# Altium project Carrier-Board-DAC.PrjPcb
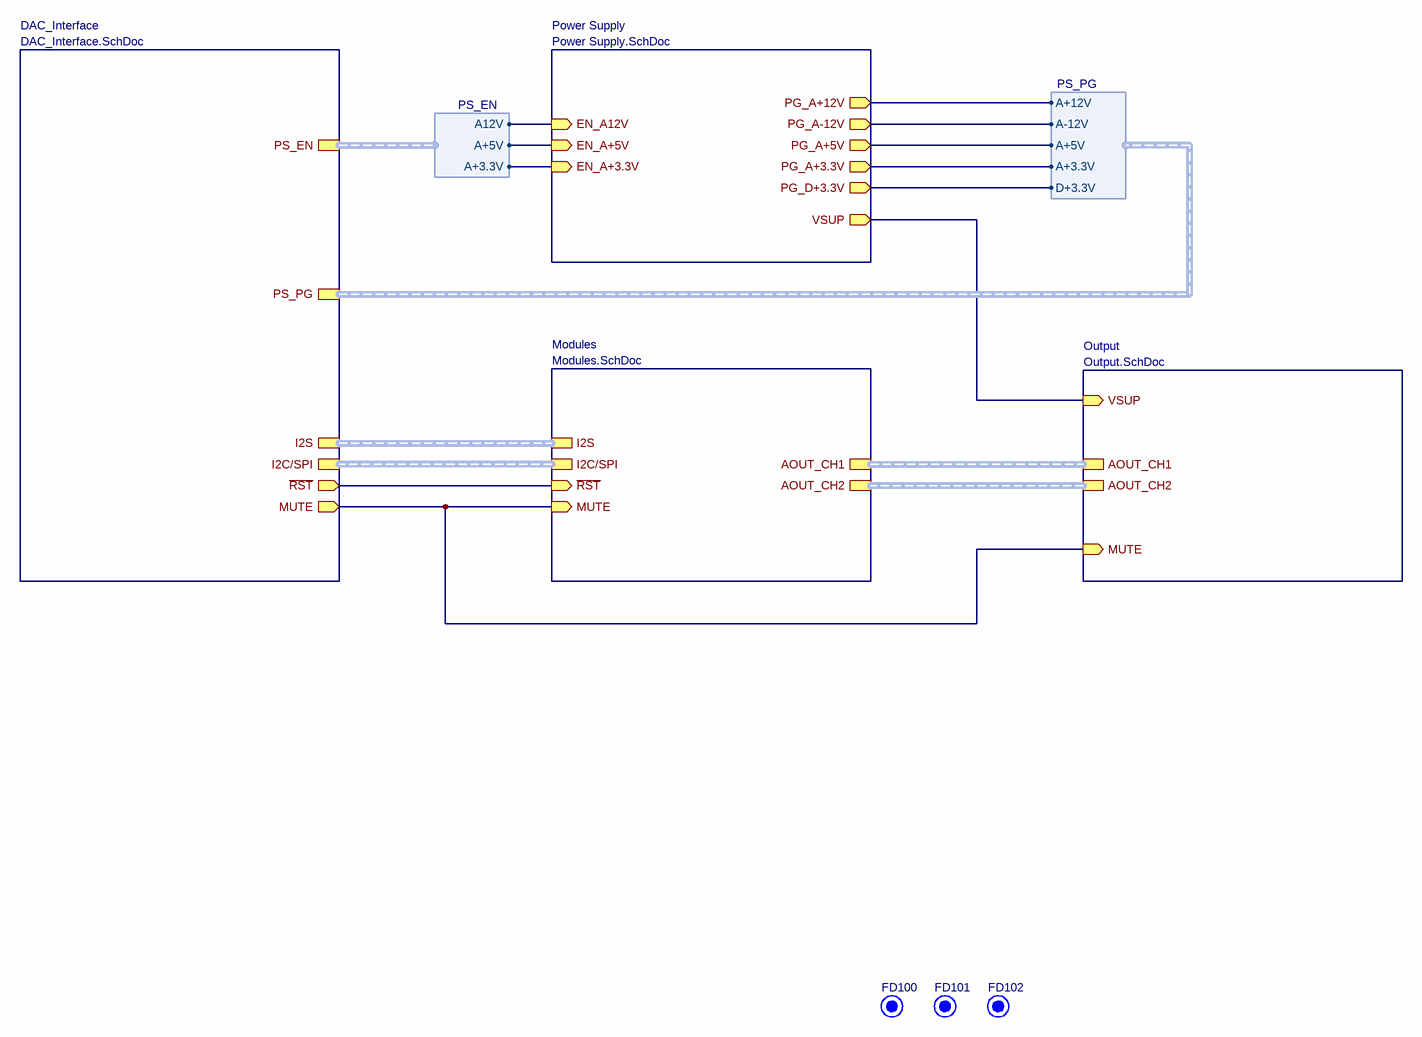
[diagram p0: Hardware Achitecture.SchDoc]
ProjectAuthors: Klossner, Lüthi; ProjectName: Carrier-Board-DAC; Revision: 1.1
5 sheets, 158 parts. Net scope: hierarchical (ports join the sheet entries above them; power ports are global).
Board file: Carrier-Board-DAC.PcbDoc
Sheets:
  Hardware Achitecture.SchDoc
    Power Supply = Power Supply.SchDoc
    DAC_Interface = DAC_Interface.SchDoc
    Modules = Modules.SchDoc
    Output = Output.SchDoc

## Sheet Hardware Achitecture.SchDoc
size A3; Date: 27.05.2014; DrawnBy: luths8; Organization: BFH; Address1: Bern University of Applied Sciences; Address2: Engineering and Information Technology; Address3: Jlcoweg 1; Address4: CH-3400 Burgdorf; DocumentNumber: 1; Revision: 1.1; SheetNumber: 1; SheetTotal: 5; CurrentDate: 27.05.2014

### Parts
FD100  Fiducial  [FIDUCIAL]  (value not drawn)  (no BOM)
FD101  Fiducial  [FIDUCIAL]  (value not drawn)  (no BOM)
FD102  Fiducial  [FIDUCIAL]  (value not drawn)  (no BOM)

### Sub-sheets
DAC_Interface = DAC_Interface.SchDoc: I2C/SPI (harness I2C/SPI), ~{RST} (out), I2S (harness I2S), MUTE (out), PS_PG (harness PS_PG), PS_EN (harness PS_EN)
Modules = Modules.SchDoc: I2C/SPI (harness I2C/SPI), ~{RST} (in), I2S (harness I2S), MUTE (in), AOUT_CH2 (harness AOUT), AOUT_CH1 (harness AOUT)
Output = Output.SchDoc: MUTE (in), VSUP (in), AOUT_CH2 (harness AOUT), AOUT_CH1 (harness AOUT)
Power Supply = Power Supply.SchDoc: PG_A-12V (out), EN_A12V (in), PG_A+3.3V (out), PG_D+3.3V (out), EN_A+3.3V (in), PG_A+12V (out), VSUP (out), EN_A+5V (in), PG_A+5V (out)

### Harnesses
PS_EN: A12V, A+3.3V, A+5V
PS_PG: A+12V, A-12V, A+3.3V, D+3.3V, A+5V

### Nets
~{DAC_RST}: sheet DAC_Interface/~{RST}, sheet Modules/~{RST}
DAC_MUTE: sheet DAC_Interface/MUTE, sheet Modules/MUTE, sheet Output/MUTE
PS_A12V_EN: sheet Power Supply/EN_A12V, sheet DAC_Interface/PS_EN.A12V
PS_A+3.3V_EN: sheet Power Supply/EN_A+3.3V, sheet DAC_Interface/PS_EN.A+3.3V
PS_A+3.3V_PG: sheet Power Supply/PG_A+3.3V, sheet DAC_Interface/PS_PG.A+3.3V
PS_A+5V_EN: sheet Power Supply/EN_A+5V, sheet DAC_Interface/PS_EN.A+5V
PS_A+5V_PG: sheet Power Supply/PG_A+5V, sheet DAC_Interface/PS_PG.A+5V
PS_A+12V_PG: sheet Power Supply/PG_A+12V, sheet DAC_Interface/PS_PG.A+12V
PS_A-12V_PG: sheet Power Supply/PG_A-12V, sheet DAC_Interface/PS_PG.A-12V
PS_D+3.3V_PG: sheet Power Supply/PG_D+3.3V, sheet DAC_Interface/PS_PG.D+3.3V
NetQ500_5: sheet Power Supply/VSUP, sheet Output/VSUP

### Buses and harness runs
harness sheet DAC_Interface/I2C/SPI = sheet Modules/I2C/SPI
harness sheet DAC_Interface/I2S = sheet Modules/I2S
harness sheet Modules/AOUT_CH1 = sheet Output/AOUT_CH1
harness sheet Modules/AOUT_CH2 = sheet Output/AOUT_CH2

### Notes on the sheet
- Project:
- Size:
- Sheet:
- Title:
- A3
- of
- Drawn by:
- Revision:
- Date:
- Variant:
- b
- File:

### Library data of the parts
FD100-FD102 = Fiducial: Fiducial Marker

## Sheet Power Supply.SchDoc
size A3; Date: 27.05.2014; DrawnBy: luths8; Organization: BFH; Address1: Bern University of Applied Sciences; Address2: Engineering and Information Technology; Address3: Jlcoweg 1; Address4: CH-3400 Burgdorf; DocumentNumber: 2; Revision: 1.1; SheetNumber: 2; SheetTotal: 5; CurrentDate: 27.05.2014
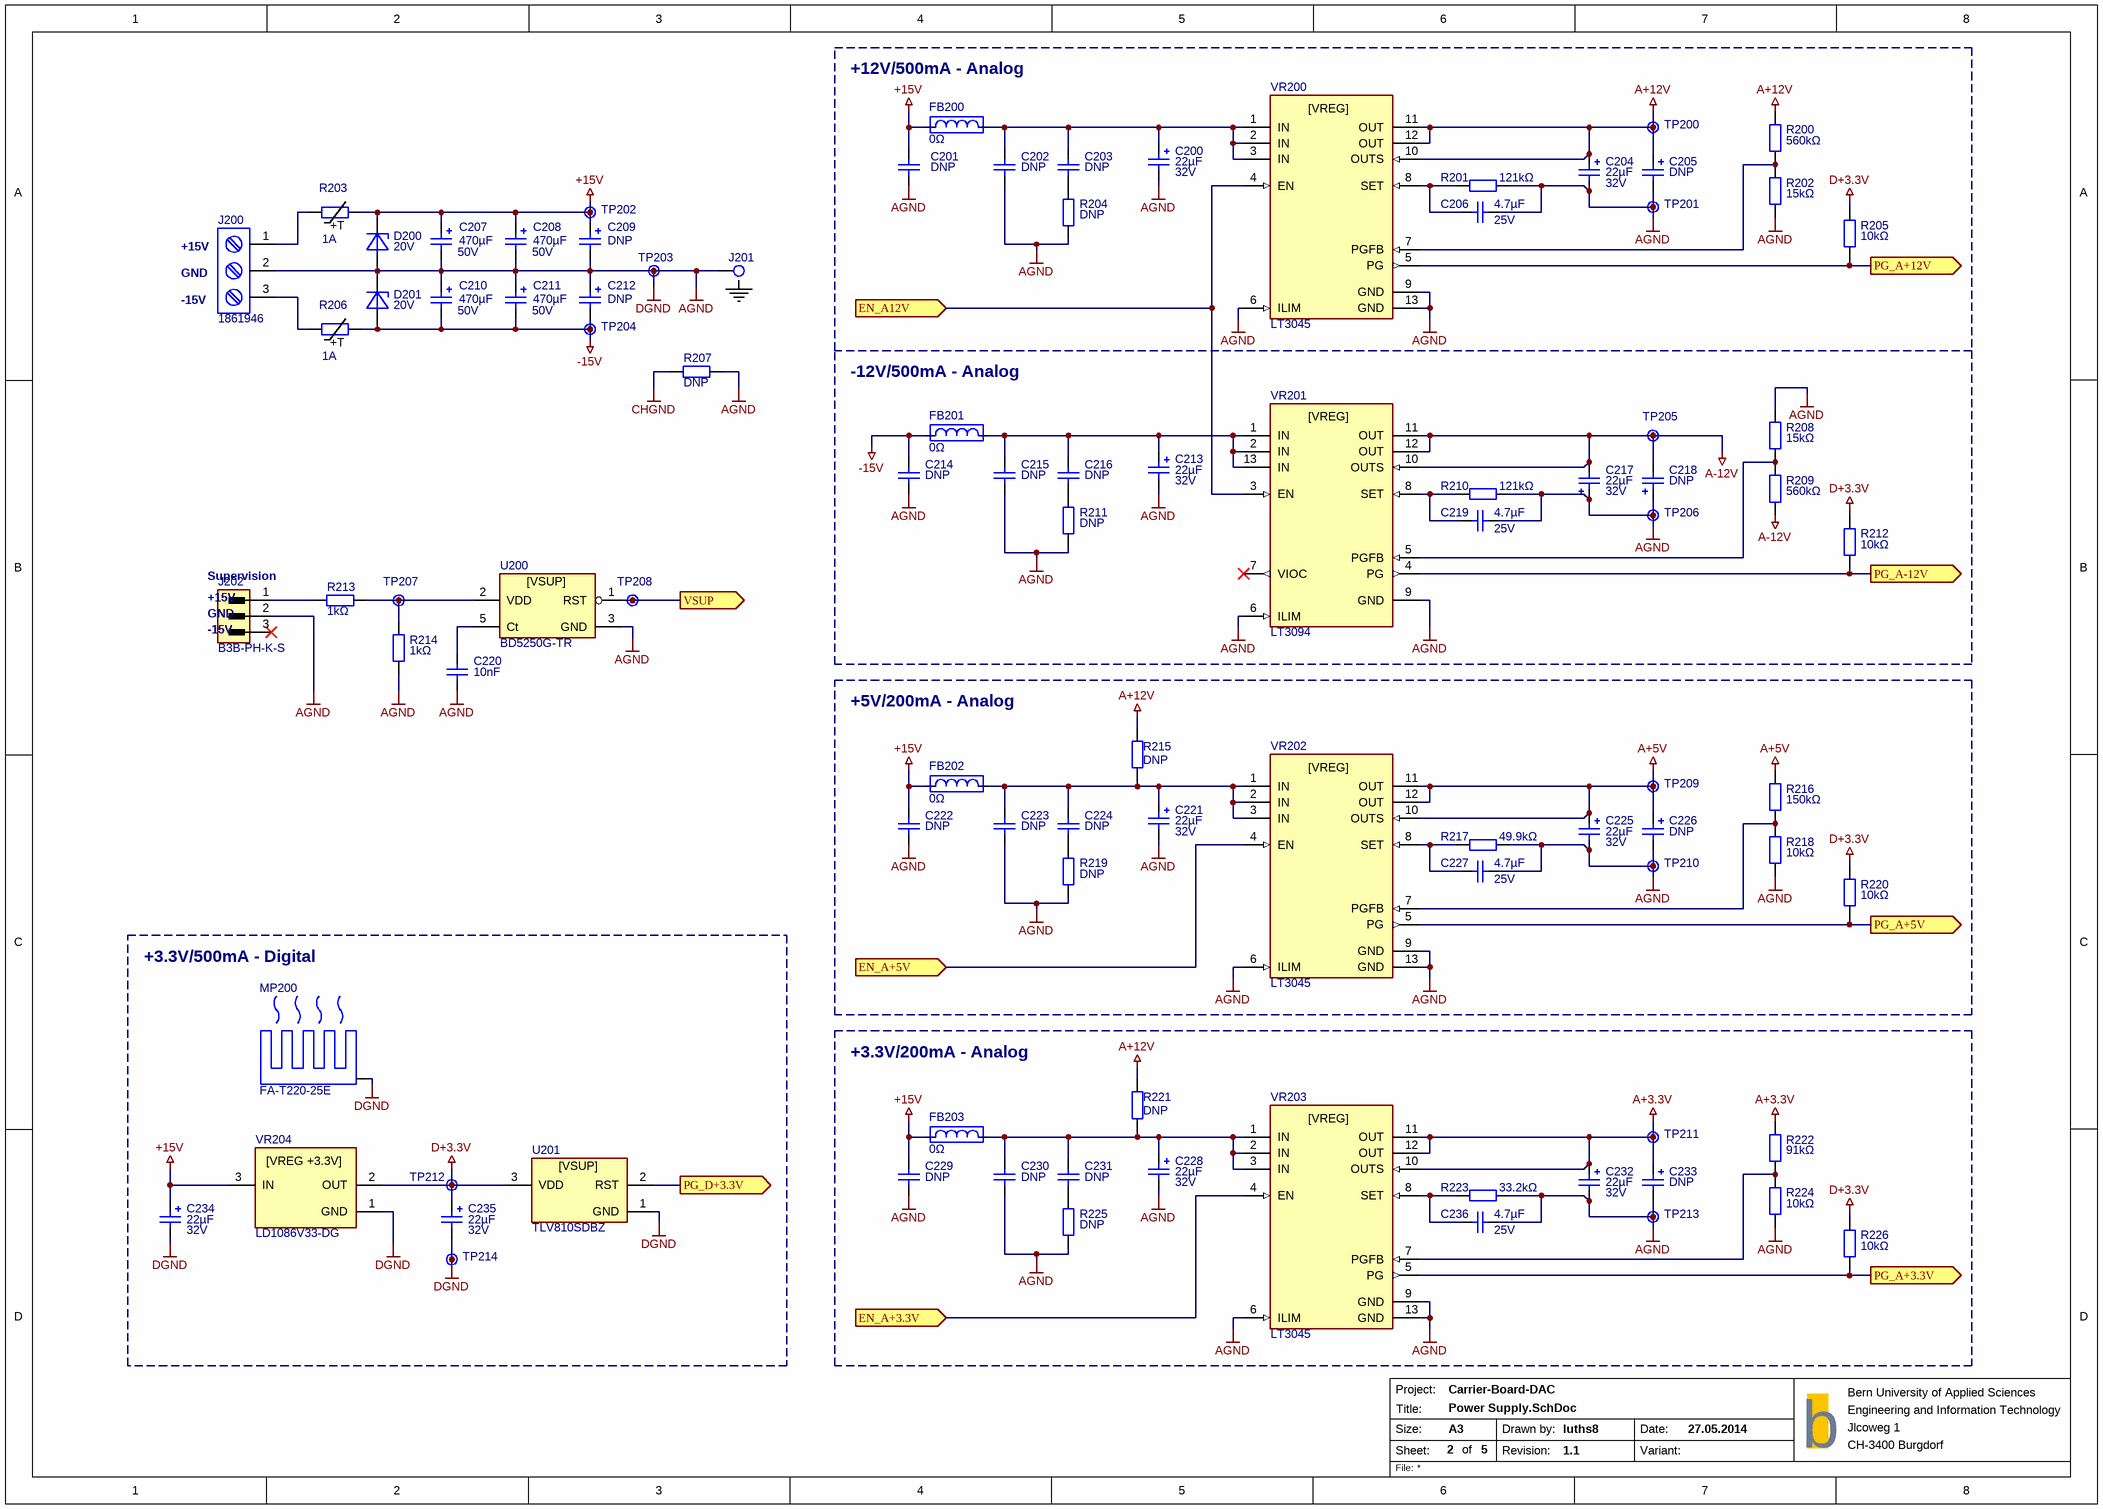
[diagram p1: Power Supply.SchDoc]

### Parts
C200  22µF  Voltage: 32V  [CAP-6.3-5.5-2.5]
C201  DNP  [SMD0805CAP]
C202  DNP  [SMD0805CAP]
C203  DNP  [SMD0805CAP]
C204  22µF  Voltage: 32V  [CAP-6.3-5.5-2.5]
C205  DNP  [CAP-6.3-5.5-2.5]
C206  4.7µF  Voltage: 25V  [SMD1206CAP]
C207  470µF  Voltage: 50V  [CAP-12.5-20-5]
C208  470µF  Voltage: 50V  [CAP-12.5-20-5]
C209  DNP  [CAP-12.5-20-5]
C210  470µF  Voltage: 50V  [CAP-12.5-20-5]
C211  470µF  Voltage: 50V  [CAP-12.5-20-5]
C212  DNP  [CAP-12.5-20-5]
C213  22µF  Voltage: 32V  [CAP-6.3-5.5-2.5]
C214  DNP  [SMD0805CAP]
C215  DNP  [SMD0805CAP]
C216  DNP  [SMD0805CAP]
C217  22µF  Voltage: 32V  [CAP-6.3-5.5-2.5]
C218  DNP  [CAP-6.3-5.5-2.5]
C219  4.7µF  Voltage: 25V  [SMD1206CAP]
C220  10nF  [SMD0603CAP]
C221  22µF  Voltage: 32V  [CAP-6.3-5.5-2.5]
C222  DNP  [SMD0805CAP]
C223  DNP  [SMD0805CAP]
C224  DNP  [SMD0805CAP]
C225  22µF  Voltage: 32V  [CAP-6.3-5.5-2.5]
C226  DNP  [CAP-6.3-5.5-2.5]
C227  4.7µF  Voltage: 25V  [SMD1206CAP]
C228  22µF  Voltage: 32V  [CAP-6.3-5.5-2.5]
C229  DNP  [SMD0805CAP]
C230  DNP  [SMD0805CAP]
C231  DNP  [SMD0805CAP]
C232  22µF  Voltage: 32V  [CAP-6.3-5.5-2.5]
C233  DNP  [CAP-6.3-5.5-2.5]
C234  22µF  Voltage: 32V  [CAP-6.3-5.5-2.5]
C235  22µF  Voltage: 32V  [CAP-6.3-5.5-2.5]
C236  4.7µF  Voltage: 25V  [SMD1206CAP]
D200  20V  [DO-214AA]
D201  20V  [DO-214AA]
FB200  0Ω  [SMD0603RES]
FB201  0Ω  [SMD0603RES]
FB202  0Ω  [SMD0603RES]
FB203  0Ω  [SMD0603RES]
J200  1861946  [1861946]
J201  Solder Pin  [SOLDER_PIN]  (value not drawn)  (net tie, no BOM)
J202  B3B-PH-K-S  [B3B-PH-K-S]
MP200  FA-T220-25E  [FA-T220-25E]
R200  560kΩ  [SMD0603RES]
R201  121kΩ  [SMD0603RES]
R202  15kΩ  [SMD0603RES]
R203  1A  [SMD2920FUSE]
R204  DNP  [SMD0603RES]
R205  10kΩ  [SMD0603RES]
R206  1A  [SMD2920FUSE]
R207  DNP  [SMD0805RES]
R208  15kΩ  [SMD0603RES]
R209  560kΩ  [SMD0603RES]
R210  121kΩ  [SMD0603RES]
R211  DNP  [SMD0603RES]
R212  10kΩ  [SMD0603RES]
R213  1kΩ  [SMD0603RES]
R214  1kΩ  [SMD0603RES]
R215  DNP  [SMD0603RES]
R216  150kΩ  [SMD0603RES]
R217  49.9kΩ  [SMD0603RES]
R218  10kΩ  [SMD0603RES]
R219  DNP  [SMD0603RES]
R220  10kΩ  [SMD0603RES]
R221  DNP  [SMD0603RES]
R222  91kΩ  [SMD0603RES]
R223  33.2kΩ  [SMD0603RES]
R224  10kΩ  [SMD0603RES]
R225  DNP  [SMD0603RES]
R226  10kΩ  [SMD0603RES]
TP200  Testpoint  [TP]  (value not drawn)  (no BOM)
TP201  Testpoint  [TP]  (value not drawn)  (no BOM)
TP202  Testpoint  [TP]  (value not drawn)  (no BOM)
TP203  Testpoint  [TP]  (value not drawn)  (no BOM)
TP204  Testpoint  [TP]  (value not drawn)  (no BOM)
TP205  Testpoint  [TP]  (value not drawn)  (no BOM)
TP206  Testpoint  [TP]  (value not drawn)  (no BOM)
TP207  Testpoint  [TP]  (value not drawn)  (no BOM)
TP208  Testpoint  [TP]  (value not drawn)  (no BOM)
TP209  Testpoint  [TP]  (value not drawn)  (no BOM)
TP210  Testpoint  [TP]  (value not drawn)  (no BOM)
TP211  Testpoint  [TP]  (value not drawn)  (no BOM)
TP212  Testpoint  [TP]  (value not drawn)  (no BOM)
TP213  Testpoint  [TP]  (value not drawn)  (no BOM)
TP214  Testpoint  [TP]  (value not drawn)  (no BOM)
U200  BD5250G-TR  [SOT-23-5]
U201  TLV810SDBZ  [SOT-23]
VR200  LT3045  [MSOP12]
VR201  LT3094  [MSOP12]
VR202  LT3045  [MSOP12]
VR203  LT3045  [MSOP12]
VR204  LD1086V33-DG  [TO220-3]

### Blocks framed on the sheet
+12V/500mA - Analog: C200-C206 FB200 R200-R202 R204 R205 TP200 TP201 VR200
+5V/200mA - Analog: C221-C227 FB202 R215-R220 TP209 TP210 VR202
+3.3V/500mA - Digital: C234 C235 MP200 TP212 TP214 U201 VR204
+3.3V/200mA - Analog: C228-C233 C236 FB203 R221-R226 TP211 TP213 VR203

### Ports
EN_A12V (in), EN_A+3.3V (in), EN_A+5V (in), PG_A+3.3V (out), PG_A+5V (out), PG_A+12V (out), PG_A-12V (out), PG_D+3.3V (out), VSUP (out)

### Nets
+15V: C201.2(q) C207.P C208.P C209.P C222.2(q) C229.2(q) C234.P D200.C FB200.1 FB202.1 FB203.1 R203.2 TP202.1 VR204.3(IN)
-15V: C210.M(q) C211.M(q) C212.M(q) C214.2(q) D201.A FB201.1 R206.2 TP204.1
A+3.3V: C232.P C233.P R222.2 TP211.1 VR203.10(OUTS) VR203.11(OUT) VR203.12(OUT)
A+5V: C225.P C226.P R216.2 TP209.1 VR202.10(OUTS) VR202.11(OUT) VR202.12(OUT)
A+12V: C204.P C205.P R200.2 R215.1 R221.1 TP200.1 VR200.10(OUTS) VR200.11(OUT) VR200.12(OUT)
A-12V: C217.M(q) C218.M(q) R209.2 TP205.1 VR201.10(OUTS) VR201.11(OUT) VR201.12(OUT)
AGND: C200.M(q) C201.1 C202.1 C204.M(q) C205.M(q) C206.2(q) C207.M(q) C208.M(q) C209.M(q) C210.P C211.P C212.P C213.M(q) C214.1 C215.1 C217.P C218.P C219.2(q) C220.1 C221.M(q) C222.1 C223.1 C225.M(q) C226.M(q) C227.2(q) C228.M(q) C229.1 C230.1 C232.M(q) C233.M(q) C234.M(q) C235.M(q) C236.2(q) D200.A D201.C J200.2 J201.1 J202.2 MP200.0 R201.2 R202.1 R204.1 R207.1 R208.1 R210.2 R211.1 R214.1 R217.2 R218.1 R219.1 R223.2 R224.1 R225.1 TP201.1 TP203.1 TP206.1 TP210.1 TP213.1 TP214.1 U200.3(GND) U201.1(GND) VR200.6(ILIM) VR200.9(GND) VR200.13(GND) VR201.6(ILIM) VR201.9(GND) VR202.6(ILIM) VR202.9(GND) VR202.13(GND) VR203.6(ILIM) VR203.9(GND) VR203.13(GND) VR204.1(GND)  [also labelled DGND]
CHGND: R207.2
D+3.3V: C235.P R205.2 R212.2 R220.2 R226.2 TP212.1 U201.3(VDD) VR204.2(OUT)
PS_A12V_EN: VR200.4(EN) VR201.3(EN) ; port EN_A12V
PS_A+3.3V_EN: VR203.4(EN) ; port EN_A+3.3V
PS_A+3.3V_PG: R226.1 VR203.5(PG) ; port PG_A+3.3V
PS_A+5V_EN: VR202.4(EN) ; port EN_A+5V
PS_A+5V_PG: R220.1 VR202.5(PG) ; port PG_A+5V
PS_A+12V_PG: R205.1 VR200.5(PG) ; port PG_A+12V
PS_A-12V_PG: R212.1 VR201.4(PG) ; port PG_A-12V
PS_D+3.3V_PG: U201.2(RST) ; port PG_D+3.3V
NetC200_P: C200.P C202.2(q) C203.2(q) FB200.2 VR200.1(IN) VR200.2(IN) VR200.3(IN)
NetC203_1: C203.1 R204.2
NetC206_1: C206.1 R201.1 VR200.8(SET)
NetC213_P: C213.P C215.2(q) C216.2(q) FB201.2 VR201.1(IN) VR201.2(IN) VR201.13(IN)
NetC216_1: C216.1 R211.2
NetC219_1: C219.1 R210.1 VR201.8(SET)
NetC220_2: C220.2(q) U200.5(Ct)
NetC221_P: C221.P C223.2(q) C224.2(q) FB202.2 R215.2 VR202.1(IN) VR202.2(IN) VR202.3(IN)
NetC224_1: C224.1 R219.2
NetC227_1: C227.1 R217.1 VR202.8(SET)
NetC228_P: C228.P C230.2(q) C231.2(q) FB203.2 R221.2 VR203.1(IN) VR203.2(IN) VR203.3(IN)
NetC231_1: C231.1 R225.2
NetC236_1: C236.1 R223.1 VR203.8(SET)
NetJ200_1: J200.1 R203.1
NetJ200_3: J200.3 R206.1
NetJ202_1: J202.1 R213.2
NetQ500_5: TP208.1 U200.1(RST) ; port VSUP
NetR200_1: R200.1 R202.2 VR200.7(PGFB)
NetR208_2: R208.2 R209.1 VR201.5(PGFB)
NetR213_1: R213.1 R214.2 TP207.1 U200.2(VDD)
NetR216_1: R216.1 R218.2 VR202.7(PGFB)
NetR222_1: R222.1 R224.2 VR203.7(PGFB)

Not connected (* = marked no-connect by the designer): J202 3*; VR201 7(VIOC)*

### Notes on the sheet
- (near J200) +15V
- (near J200) GND
- (near J200) -15V
- (near FB201) -12V/500mA - Analog
- (near J202) Supervision
- (near J202) +15V
- (near J202) GND
- (near J202) -15V
- Project:
- Size:
- Sheet:
- Title:
- A3
- of
- Drawn by:
- Revision:
- Date:
- Variant:
- b
- File:
- (in symbol LD1086V33-DG) [VREG +3.3V]
- (in symbol LT3045) [VREG]
- (in symbol LT3094) [VREG]
- (in symbol Polyfuse) +T
- (in symbol Voltage Supervisor) [VSUP]
- (in symbol Voltage Supervisor 5V) [VSUP]

### Library data of the parts
C200 C204 C213 C217 C221 C225 C228 C232 C234 C235 = Capacitor Electrolytic: Elektrolytic Capacitor; Manufacturer Part No.: 32SEPF22M
C201-C203 C214-C216 C220 C222-C224 C229-C231 = Capacitor Ceramic: Ceramic Capacitor; Voltage: 25V; Manufacturer Part No.: *
C205 C218 C226 C233 = Capacitor Electrolytic: Elektrolytic Capacitor; Manufacturer Part No.: 32SEPF22M; Voltage: 32V
C206 C219 C227 C236 = Capacitor Ceramic: Ceramic Capacitor; Manufacturer Part No.: *
C207 C208 C210 C211 = Capacitor Electrolytic: Elektrolytic Capacitor; Manufacturer Part No.: EEU-FR1H471
C209 C212 = Capacitor Electrolytic: Elektrolytic Capacitor; Manufacturer Part No.: EEU-FR1H471; Voltage: 50V
D200 D201 = Diode Zener: Zener Diode; Manufacturer Part No.: SMBJ5357B-TP
FB200-FB203 = Ferrite Bead: Manufacturer Part No.: *
J200 = 1861946: Screw Terminal, 3 Position; System: Connector; Manufacturer Part No.: 1861946
J202 = Connector 3x1P: Manufacturer Part No.: B3B-PH-K-S; System: Connector
MP200 = Heatsink: Manufacturer Part No.: FA-T220-25E
R200-R202 R204 R205 R207-R226 = Resistor: Manufacturer Part No.: *
R203 R206 = Polyfuse: Manufacturer Part No.: 0ZCF0100AF2A
U200 = Voltage Supervisor 5V: Voltage Supervisor, Threshold 5V; Manufacturer Part No.: BD5250G-TR
U201 = Voltage Supervisor: Voltage Supervisor, Threshold 2.94V; Manufacturer Part No.: TLV810SDBZR
VR200 VR202 VR203 = LT3045: Linear Regulator, positive Rail, Low Noise, High PSRR; Manufacturer Part No.: LT3045EMSE#PBF
VR201 = LT3094: Linear Regulator, negative Rail Low Noise, High PSRR; Manufacturer Part No.: LT3094EMSE#PBF
VR204 = LD1086V33-DG: Linear Voltage Regulator, positive Rail; Manufacturer Part No.: LD1086V33-DG
TP200-TP214 = Testpoint: Manufacturer Part No.: *

## Sheet DAC_Interface.SchDoc
size A3; PageSetup: Record=PageOptions|CenterHorizontal=True|CenterVertical=True|PrintScale=0.71|XCorrection=1.00|YCorrection=1.00|PrintKind=0|BorderSize=5000000|LeftOffset=0|BottomOffset=0|Orientation=2|PaperLength=1000|PaperWidth=1000|Scale=100|PaperSource=7|PrintQuality=-4|MediaType=1|DitherType=10|PaperKind=A4|PrintScaleMode=1; Date: 27.05.2014; DrawnBy: luths8; Organization: BFH; Address1: Bern University of Applied Sciences; Address2: Engineering and Information Technology; Address3: Jlcoweg 1; Address4: CH-3400 Burgdorf; DocumentNumber: 3; Revision: 1.1; SheetNumber: 3; SheetTotal: 5; CurrentDate: 27.05.2014
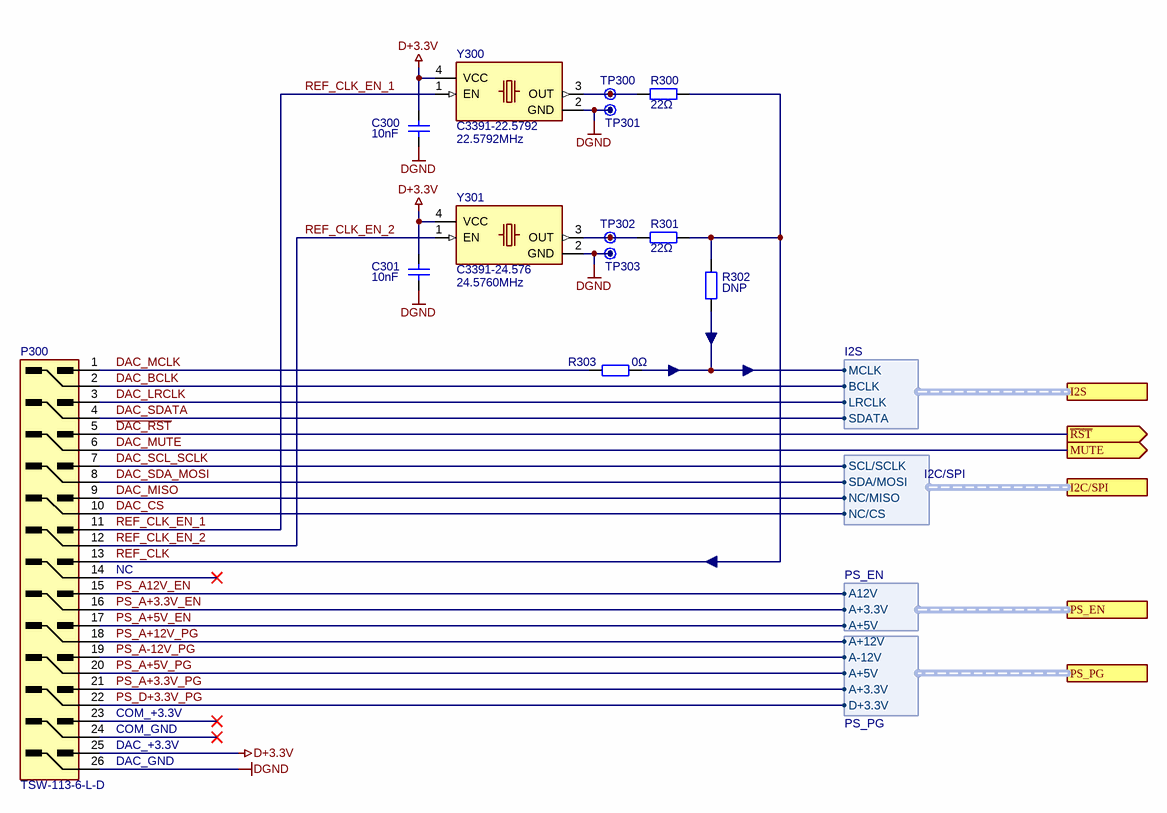
[diagram p2: DAC_Interface.SchDoc]

### Parts
C300  10nF  [SMD0603CAP]
C301  10nF  [SMD0603CAP]
P300  TSW-113-6-L-D  [HEADER_2x13P_VERTICAL]
R300  22Ω  [SMD0603RES]
R301  22Ω  [SMD0603RES]
R302  DNP  [SMD0603RES]
R303  0Ω  [SMD0603RES]
TP300  Testpoint  [TP]  (value not drawn)  (no BOM)
TP301  Testpoint  [TP]  (value not drawn)  (no BOM)
TP302  Testpoint  [TP]  (value not drawn)  (no BOM)
TP303  Testpoint  [TP]  (value not drawn)  (no BOM)
Y300  C3391-22.5792  Frequency: 22.5792MHz  [OSC_CRYSTEK]
Y301  C3391-24.576  Frequency: 24.5760MHz  [OSC_CRYSTEK]

### Ports
I2C/SPI (harness I2C/SPI), I2S (harness I2S), MUTE (out), PS_EN (harness PS_EN), PS_PG (harness PS_PG), ~{RST} (out)

### Harnesses
PS_EN: A12V, A+3.3V, A+5V
PS_PG: A+12V, A-12V, A+3.3V, A+5V, D+3.3V
I2S: MCLK, BCLK, LRCLK, SDATA
I2C/SPI: SCL/SCLK, SDA/MOSI, NC/MISO, NC/CS

### Nets
D+3.3V: C300.1 C301.1 P300.25 Y300.4(VCC) Y301.4(VCC)
DGND: C300.2(q) C301.2(q) P300.26 TP301.1 TP303.1 Y300.2(GND) Y301.2(GND)  [project net AGND]
~{DAC_RST}: P300.5 ; port ~{RST}
DAC_BCLK: P300.2 ; port I2S.BCLK
DAC_CS: P300.10 ; port I2C/SPI.NC/CS
DAC_LRCLK: P300.3 ; port I2S.LRCLK
DAC_MCLK: P300.1 R303.2
DAC_MISO: P300.9 ; port I2C/SPI.NC/MISO
DAC_MUTE: P300.6 ; port MUTE
DAC_SCL_SCLK: P300.7 ; port I2C/SPI.SCL/SCLK
DAC_SDA_MOSI: P300.8 ; port I2C/SPI.SDA/MOSI
DAC_SDATA: P300.4 ; port I2S.SDATA
PS_A12V_EN: P300.15 ; port PS_EN.A12V
PS_A+3.3V_EN: P300.16 ; port PS_EN.A+3.3V
PS_A+3.3V_PG: P300.21 ; port PS_PG.A+3.3V
PS_A+5V_EN: P300.17 ; port PS_EN.A+5V
PS_A+5V_PG: P300.20 ; port PS_PG.A+5V
PS_A+12V_PG: P300.18 ; port PS_PG.A+12V
PS_A-12V_PG: P300.19 ; port PS_PG.A-12V
PS_D+3.3V_PG: P300.22 ; port PS_PG.D+3.3V
REF_CLK: P300.13 R300.2 R301.2 R302.1
REF_CLK_EN_1: P300.11 Y300.1(EN)
REF_CLK_EN_2: P300.12 Y301.1(EN)
NetP400_1: R302.2 R303.1 ; port I2S.MCLK
NetR300_1: R300.1 TP300.1 Y300.3(OUT)
NetR301_1: R301.1 TP302.1 Y301.3(OUT)

Not connected (* = marked no-connect by the designer): P300 14* 23* 24*

### Notes on the sheet
- (near P300) NC
- (near P300) COM_+3.3V
- (near P300) COM_GND
- (near P300) DAC_GND
- (near P300) DAC_+3.3V
- Project:
- Size:
- Sheet:
- Title:
- A3
- of
- Drawn by:
- Revision:
- Date:
- Variant:
- b
- File:

### Library data of the parts
C300 C301 = Capacitor Ceramic: Ceramic Capacitor; Voltage: *; Manufacturer Part No.: *
P300 = Header 13x2P: Manufacturer Part No.: TSW-113-6-L-D
R300-R303 = Resistor: Manufacturer Part No.: *
Y300 Y301 = Oscillator Crystek: HCMOS Oscillator
  Y300: Manufacturer Part No.: C3391-22.5792
  Y301: Manufacturer Part No.: C3391-24.576
TP300-TP303 = Testpoint: Manufacturer Part No.: *

## Sheet Modules.SchDoc
size A3; Date: 27.05.2014; DrawnBy: luths8; Organization: BFH; Address1: Bern University of Applied Sciences; Address2: Engineering and Information Technology; Address3: Jlcoweg 1; Address4: CH-3400 Burgdorf; DocumentNumber: 4; Revision: 1.1; SheetNumber: 4; SheetTotal: 5; CurrentDate: 27.05.2014
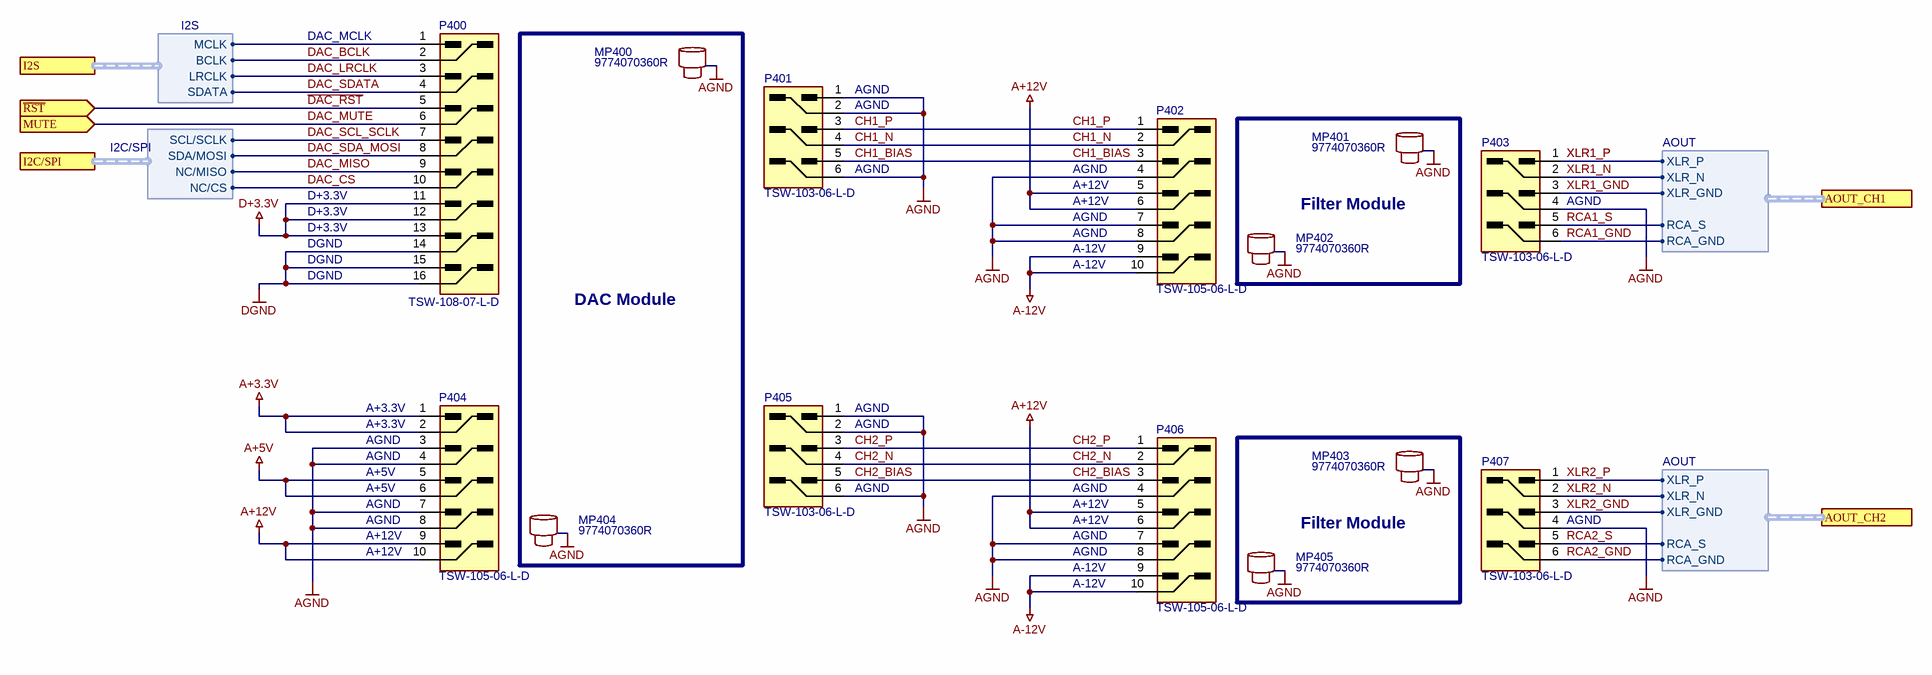
[diagram p3: Modules.SchDoc]

### Parts
MP400  9774070360R  [9774070360]
MP401  9774070360R  [9774070360]
MP402  9774070360R  [9774070360]
MP403  9774070360R  [9774070360]
MP404  9774070360R  [9774070360]
MP405  9774070360R  [9774070360]
P400  TSW-108-07-L-D  [TSW-108-06-X-D]
P401  TSW-103-06-L-D  [TSW-103-06-X-D]
P402  TSW-105-06-L-D  [TSW-105-06-X-D]
P403  TSW-103-06-L-D  [TSW-103-06-X-D]
P404  TSW-105-06-L-D  [TSW-105-06-X-D]
P405  TSW-103-06-L-D  [TSW-103-06-X-D]
P406  TSW-105-06-L-D  [TSW-105-06-X-D]
P407  TSW-103-06-L-D  [TSW-103-06-X-D]

### Blocks framed on the sheet
DAC Module: MP400 MP404
Filter Module: MP401 MP402
Filter Module: MP403 MP405

### Ports
AOUT_CH1 (harness AOUT), AOUT_CH2 (harness AOUT), I2C/SPI (harness I2C/SPI), I2S (harness I2S), MUTE (in), ~{RST} (in)

### Harnesses
I2S: MCLK, BCLK, LRCLK, SDATA
I2C/SPI: SCL/SCLK, SDA/MOSI, NC/MISO, NC/CS
AOUT: XLR_P, XLR_N, XLR_GND, RCA_S, RCA_GND

### Nets
A+3.3V: P404.1 P404.2
A+5V: P404.5 P404.6
A+12V: P402.5 P402.6 P404.9 P404.10 P406.5 P406.6
A-12V: P402.9 P402.10 P406.9 P406.10
AGND: MP400.1 MP401.1 MP402.1 MP403.1 MP404.1 MP405.1 P400.14 P400.15 P400.16 P401.1 P401.2 P401.6 P402.4 P402.7 P402.8 P403.4 P404.3 P404.4 P404.7 P404.8 P405.1 P405.2 P405.6 P406.4 P406.7 P406.8 P407.4  [also labelled DGND]
D+3.3V: P400.11 P400.12 P400.13
CH1_BIAS: P401.5 P402.3
CH1_N: P401.4 P402.2
CH1_P: P401.3 P402.1
CH2_BIAS: P405.5 P406.3
CH2_N: P405.4 P406.2
CH2_P: P405.3 P406.1
~{DAC_RST}: P400.5 ; port ~{RST}
DAC_BCLK: P400.2 ; port I2S.BCLK
DAC_CS: P400.10 ; port I2C/SPI.NC/CS
DAC_LRCLK: P400.3 ; port I2S.LRCLK
DAC_MISO: P400.9 ; port I2C/SPI.NC/MISO
DAC_MUTE: P400.6 ; port MUTE
DAC_SCL_SCLK: P400.7 ; port I2C/SPI.SCL/SCLK
DAC_SDA_MOSI: P400.8 ; port I2C/SPI.SDA/MOSI
DAC_SDATA: P400.4 ; port I2S.SDATA
RCA1_GND: P403.6 ; port AOUT_CH1.RCA_GND
RCA1_S: P403.5 ; port AOUT_CH1.RCA_S
RCA2_GND: P407.6 ; port AOUT_CH2.RCA_GND
RCA2_S: P407.5 ; port AOUT_CH2.RCA_S
XLR1_GND: P403.3 ; port AOUT_CH1.XLR_GND
XLR1_N: P403.2 ; port AOUT_CH1.XLR_N
XLR1_P: P403.1 ; port AOUT_CH1.XLR_P
XLR2_GND: P407.3 ; port AOUT_CH2.XLR_GND
XLR2_N: P407.2 ; port AOUT_CH2.XLR_N
XLR2_P: P407.1 ; port AOUT_CH2.XLR_P
NetP400_1: P400.1 ; port I2S.MCLK

### Notes on the sheet
- DAC_MCLK
- (near P401) AGND
- D+3.3V
- AGND
- A+12V
- (near P403) AGND
- DGND
- A-12V
- (near P404) A+3.3V
- (near P405) AGND
- (near P404) AGND
- (near P404) A+5V
- (near P404) A+12V
- (near P407) AGND
- Project:
- Size:
- Sheet:
- Title:
- A3
- of
- Drawn by:
- Revision:
- Date:
- Variant:
- b
- File:

### Library data of the parts
MP400-MP405 = Spacer M3 SMD Net: Spacer M3 SMD; Manufacturer Part No.: 9774070360R
P400 = Header 8x2P: Manufacturer Part No.: TSW-108-07-L-D
P401 P403 P405 P407 = Header 3x2P: Header 13x2P; Manufacturer Part No.: TSW-103-06-L-D
P402 P404 P406 = Header 5x2P: Manufacturer Part No.: TSW-105-06-L-D

## Sheet Output.SchDoc
size A3; Date: 27.05.2014; DrawnBy: luths8; Organization: BFH; Address1: Bern University of Applied Sciences; Address2: Engineering and Information Technology; Address3: Jlcoweg 1; Address4: CH-3400 Burgdorf; DocumentNumber: 5; Revision: 1.1; SheetNumber: 5; SheetTotal: 5; CurrentDate: 27.05.2014
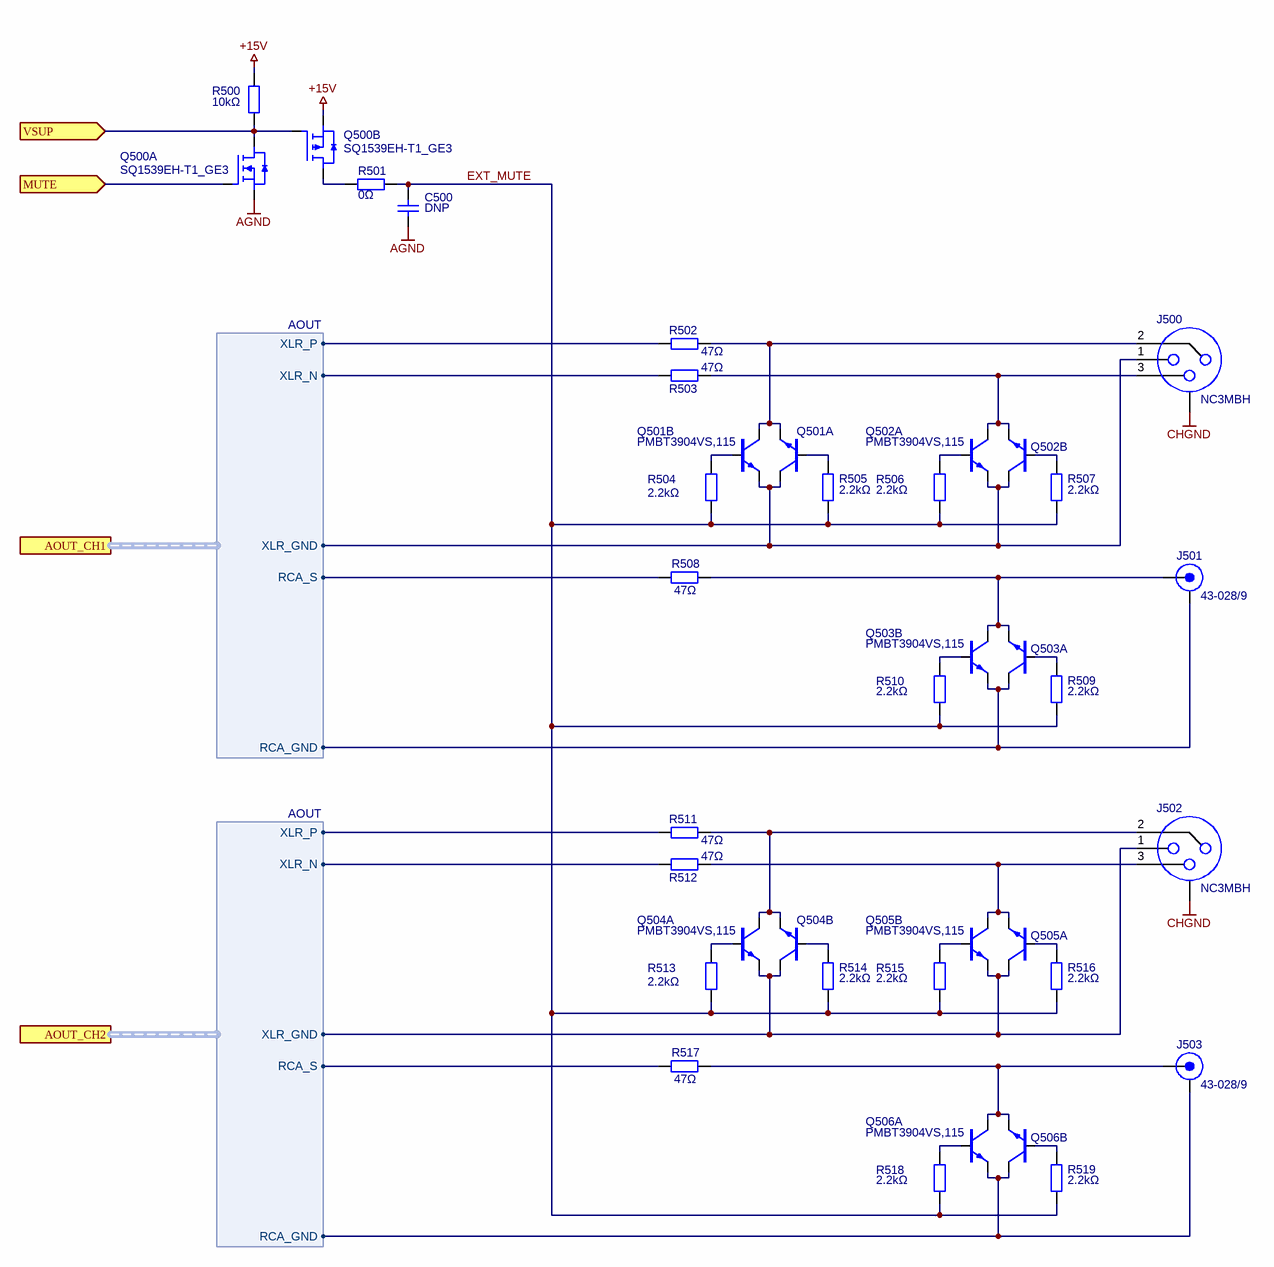
[diagram p4: Output.SchDoc]

### Parts
C500  DNP  [SMD0603CAP]
J500  NC3MBH  [NC3MBH]
J501  43-028/9  [RCA-Plug]
J502  NC3MBH  [NC3MBH]
J503  43-028/9  [RCA-Plug]
Q500  SQ1539EH-T1_GE3  [SOT-363-6]  (parts A,B of 2)
Q501  PMBT3904VS,115  [SOT-666]  (value not drawn)  (parts A,B of 2)
Q502  PMBT3904VS,115  [SOT-666]  (parts A,B of 2)
Q503  PMBT3904VS,115  [SOT-666]  (value not drawn)  (parts A,B of 2)
Q504  PMBT3904VS,115  [SOT-666]  (parts A,B of 2)
Q505  PMBT3904VS,115  [SOT-666]  (value not drawn)  (parts A,B of 2)
Q506  PMBT3904VS,115  [SOT-666]  (parts A,B of 2)
R500  10kΩ  [SMD0603RES]
R501  0Ω  [SMD0603RES]
R502  47Ω  [SMD0603RES]
R503  47Ω  [SMD0603RES]
R504  2.2kΩ  [SMD0603RES]
R505  2.2kΩ  [SMD0603RES]
R506  2.2kΩ  [SMD0603RES]
R507  2.2kΩ  [SMD0603RES]
R508  47Ω  [SMD0603RES]
R509  2.2kΩ  [SMD0603RES]
R510  2.2kΩ  [SMD0603RES]
R511  47Ω  [SMD0603RES]
R512  47Ω  [SMD0603RES]
R513  2.2kΩ  [SMD0603RES]
R514  2.2kΩ  [SMD0603RES]
R515  2.2kΩ  [SMD0603RES]
R516  2.2kΩ  [SMD0603RES]
R517  47Ω  [SMD0603RES]
R518  2.2kΩ  [SMD0603RES]
R519  2.2kΩ  [SMD0603RES]

### Ports
AOUT_CH1 (harness AOUT), AOUT_CH2 (harness AOUT), MUTE (in), VSUP (in)

### Harnesses
AOUT: XLR_P, XLR_N, XLR_GND, RCA_S, RCA_GND

### Nets
+15V: Q500.4(S) R500.2
AGND: C500.2(q) Q500.1(S)
CHGND: J500.0 J502.0
DAC_MUTE: Q500.2(G) ; port MUTE
EXT_MUTE: C500.1 R501.1 R504.1 R505.1 R506.1 R507.1 R509.1 R510.1 R513.1 R514.1 R515.1 R516.1 R518.1 R519.1
RCA1_GND: J501.2 Q503.4 Q503.6 ; port AOUT_CH1.RCA_GND
RCA1_S: R508.2 ; port AOUT_CH1.RCA_S
RCA2_GND: J503.2 Q506.1 Q506.3 ; port AOUT_CH2.RCA_GND
RCA2_S: R517.2 ; port AOUT_CH2.RCA_S
XLR1_GND: J500.1 Q501.4 Q501.6 Q502.1 Q502.3 ; port AOUT_CH1.XLR_GND
XLR1_N: R503.2 ; port AOUT_CH1.XLR_N
XLR1_P: R502.2 ; port AOUT_CH1.XLR_P
XLR2_GND: J502.1 Q504.1 Q504.3 Q505.4 Q505.6 ; port AOUT_CH2.XLR_GND
XLR2_N: R512.2 ; port AOUT_CH2.XLR_N
XLR2_P: R511.2 ; port AOUT_CH2.XLR_P
NetJ500_2: J500.2 Q501.1 Q501.3 R502.1
NetJ500_3: J500.3 Q502.4 Q502.6 R503.1
NetJ501_1: J501.1 Q503.1 Q503.3 R508.1
NetJ502_2: J502.2 Q504.4 Q504.6 R511.1
NetJ502_3: J502.3 Q505.1 Q505.3 R512.1
NetJ503_1: J503.1 Q506.4 Q506.6 R517.1
NetQ500_3: Q500.3(D) R501.2
NetQ500_5: Q500.5(G) Q500.6(D) R500.1 ; port VSUP
NetQ501_2: Q501.2 R505.2
NetQ501_5: Q501.5 R504.2
NetQ502_2: Q502.2 R506.2
NetQ502_5: Q502.5 R507.2
NetQ503_2: Q503.2 R509.2
NetQ503_5: Q503.5 R510.2
NetQ504_2: Q504.2 R513.2
NetQ504_5: Q504.5 R514.2
NetQ505_2: Q505.2 R516.2
NetQ505_5: Q505.5 R515.2
NetQ506_2: Q506.2 R518.2
NetQ506_5: Q506.5 R519.2

### Notes on the sheet
- Project:
- Size:
- Sheet:
- Title:
- A3
- of
- Drawn by:
- Revision:
- Date:
- Variant:
- b
- File:

### Library data of the parts
C500 = Capacitor Ceramic: Ceramic Capacitor; Voltage: *; Manufacturer Part No.: *
J500 J502 = Connector XLR: XLR Connector Male, Panel Mount; Manufacturer Part No.: NC3MBH; System: Connector
J501 J503 = Connector RCA: RCA Connector; Manufacturer Part No.: *; System: Connector
Q500 = Transistor N/PMOS Dual: Transistor Dual, NMOS & PMOS; Manufacturer Part No.: SQ1539EH-T1_GE3
Q501-Q506 = Transistor Bipolar Dual: Manufacturer Part No.: PMBT3904VS,115
R500 R501 R504-R507 R509 R510 R513-R516 R518 R519 = Resistor: Manufacturer Part No.: *
R502 R503 R508 R511 R512 R517 = Resistor: Resistor Thin Film; Manufacturer Part No.: TNPW060347R0BEEA

## Nets that join several sheets
+15V: Power Supply (14 pins), Output (Q500.4 R500.2)
A+3.3V: Power Supply (7 pins), Modules (P404.1 P404.2)
A+5V: Power Supply (7 pins), Modules (P404.5 P404.6)
A+12V: Power Supply (9 pins), Modules (6 pins)
A-12V: Power Supply (7 pins), Modules (P402.9 P402.10 P406.9 P406.10)
AGND: Power Supply (73 pins), DAC_Interface (7 pins), Modules (27 pins), Output (C500.2 Q500.1)
CHGND: Power Supply (R207.2), Output (J500.0 J502.0)
D+3.3V: Power Supply (8 pins), DAC_Interface (5 pins), Modules (P400.11 P400.12 P400.13)
~{DAC_RST}: DAC_Interface (P300.5), Modules (P400.5)
DAC_BCLK: DAC_Interface (P300.2), Modules (P400.2)
DAC_CS: DAC_Interface (P300.10), Modules (P400.10)
DAC_LRCLK: DAC_Interface (P300.3), Modules (P400.3)
DAC_MISO: DAC_Interface (P300.9), Modules (P400.9)
DAC_MUTE: DAC_Interface (P300.6), Modules (P400.6), Output (Q500.2)
DAC_SCL_SCLK: DAC_Interface (P300.7), Modules (P400.7)
DAC_SDA_MOSI: DAC_Interface (P300.8), Modules (P400.8)
DAC_SDATA: DAC_Interface (P300.4), Modules (P400.4)
NetP400_1: DAC_Interface (R302.2 R303.1), Modules (P400.1)
NetQ500_5: Power Supply (TP208.1 U200.1), Output (Q500.5 Q500.6 R500.1)
PS_A12V_EN: Power Supply (VR200.4 VR201.3), DAC_Interface (P300.15)
PS_A+3.3V_EN: Power Supply (VR203.4), DAC_Interface (P300.16)
PS_A+3.3V_PG: Power Supply (R226.1 VR203.5), DAC_Interface (P300.21)
PS_A+5V_EN: Power Supply (VR202.4), DAC_Interface (P300.17)
PS_A+5V_PG: Power Supply (R220.1 VR202.5), DAC_Interface (P300.20)
PS_A+12V_PG: Power Supply (R205.1 VR200.5), DAC_Interface (P300.18)
PS_A-12V_PG: Power Supply (R212.1 VR201.4), DAC_Interface (P300.19)
PS_D+3.3V_PG: Power Supply (U201.2), DAC_Interface (P300.22)
RCA1_GND: Modules (P403.6), Output (J501.2 Q503.4 Q503.6)
RCA1_S: Modules (P403.5), Output (R508.2)
RCA2_GND: Modules (P407.6), Output (J503.2 Q506.1 Q506.3)
RCA2_S: Modules (P407.5), Output (R517.2)
XLR1_GND: Modules (P403.3), Output (5 pins)
XLR1_N: Modules (P403.2), Output (R503.2)
XLR1_P: Modules (P403.1), Output (R502.2)
XLR2_GND: Modules (P407.3), Output (5 pins)
XLR2_N: Modules (P407.2), Output (R512.2)
XLR2_P: Modules (P407.1), Output (R511.2)

## Assembly variants
Complete: not fitted C201 C202 C203 C205 C209 C212 C214 C215 C216 C218 C222 C223 C224 C226 C229 C230 C231 C233 R204 R207 R211 R214 R215 R219 R221 R225 R302